# EAGLE design ARD-80A (EAGLE 6.6.0)
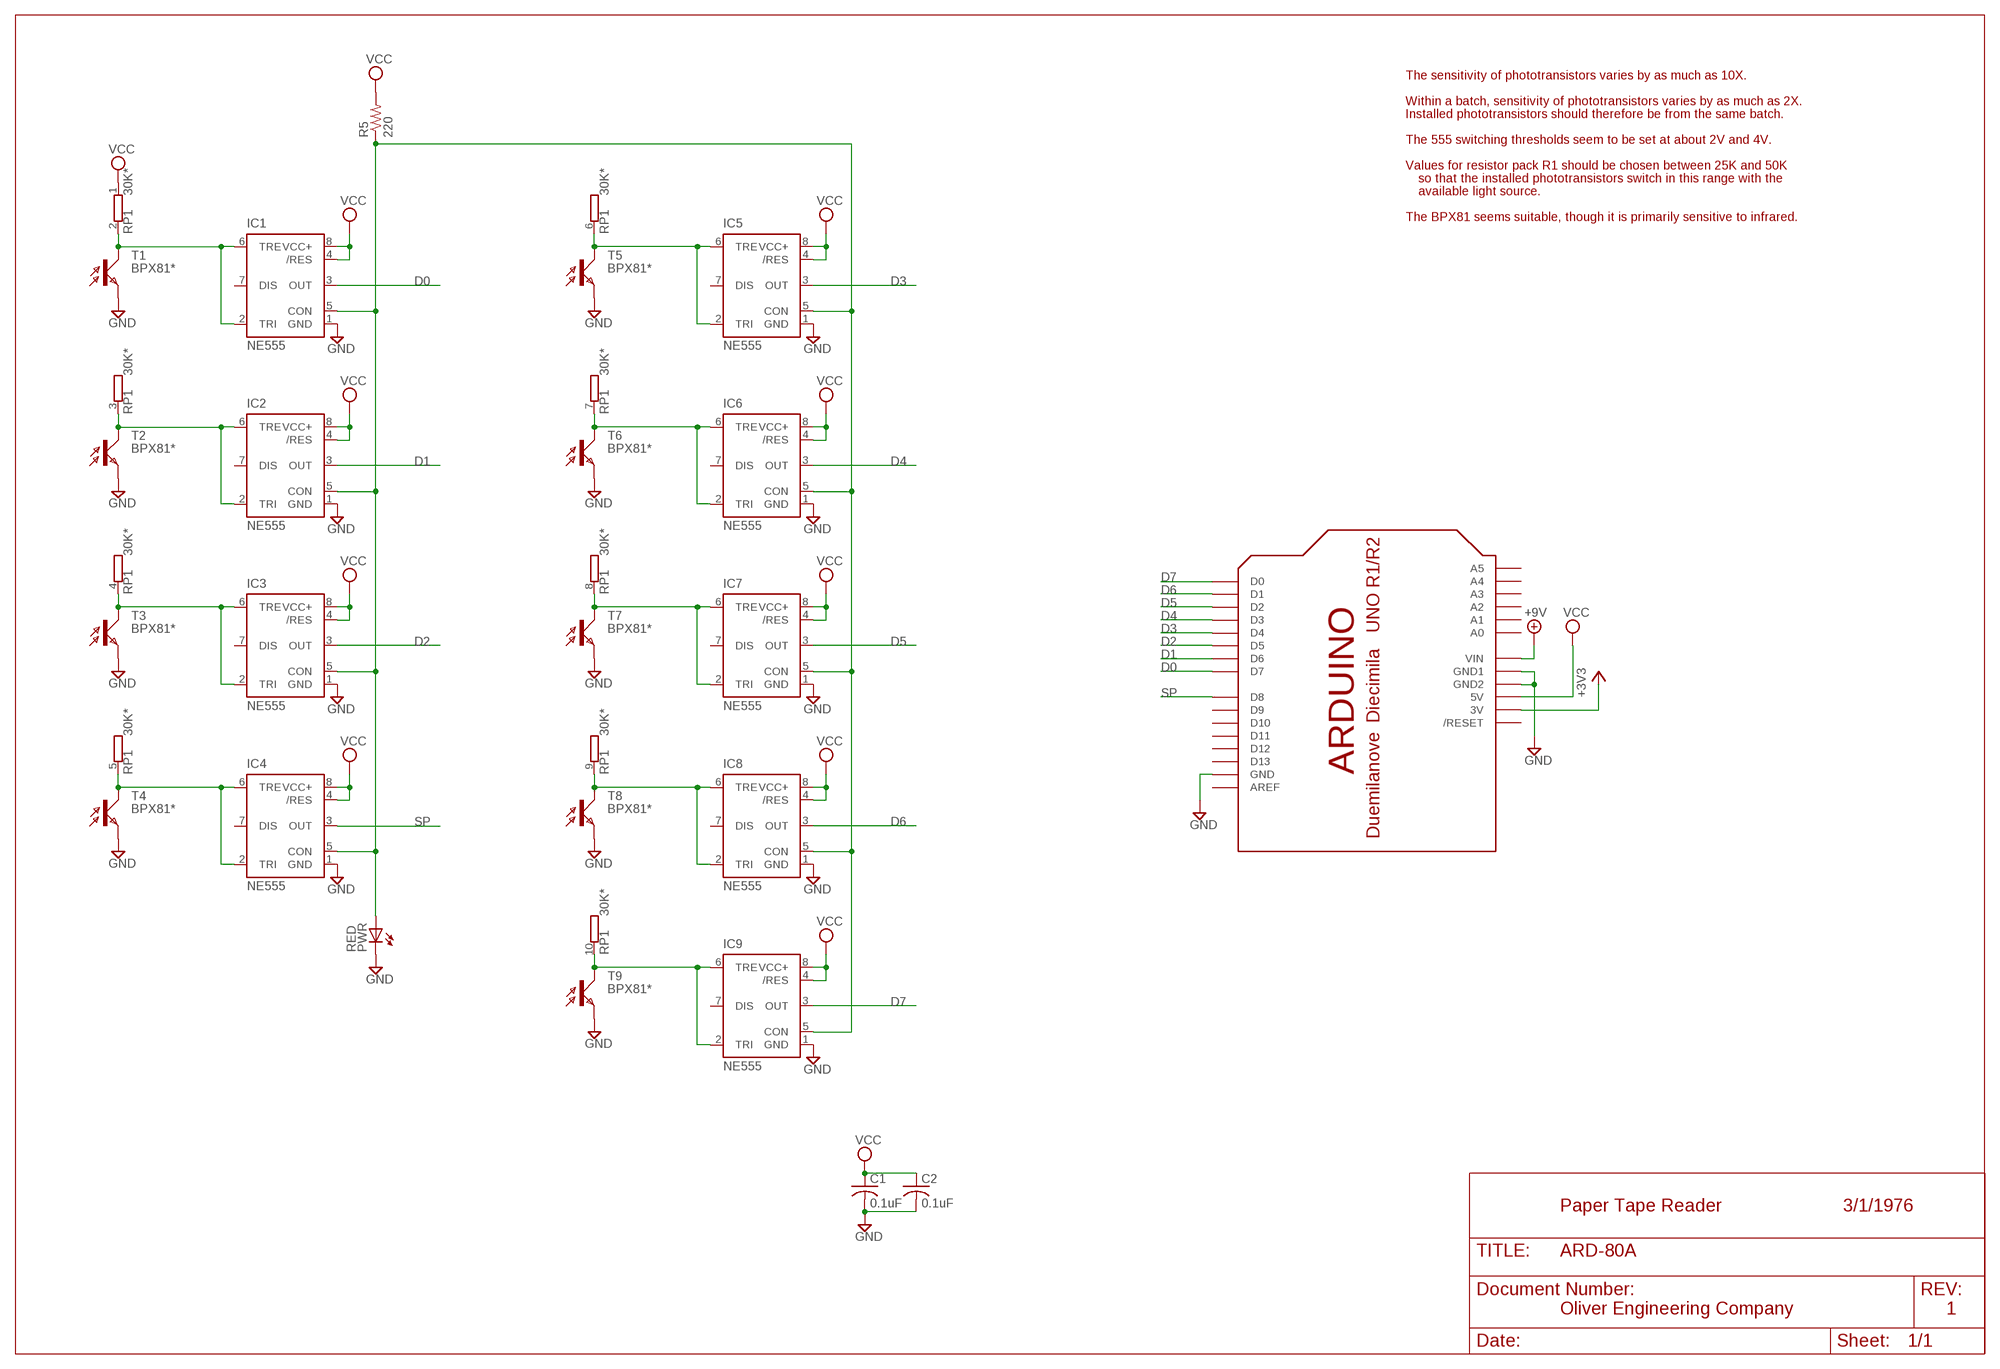
[diagram p0: schematic, sheet 1]

## Parts
C1  0.1uF  C-US050-030X075  [C050-030X075]
C2  0.1uF  C-US050-030X075  [C050-030X075]
IC1  NE555  [DIL-08]
IC2  NE555  [DIL-08]
IC3  NE555  [DIL-08]
IC4  NE555  [DIL-08]
IC5  NE555  [DIL-08]
IC6  NE555  [DIL-08]
IC7  NE555  [DIL-08]
IC8  NE555  [DIL-08]
IC9  NE555  [DIL-08]
PWR  RED  LED5MM  [LED5MM]
R5  220  R-US_0207/10  [0207/10]
RP1  30K*  GE09RP  [SIL10]
T1  BPX81*  BPX81  [BPX81]
T2  BPX81*  BPX81  [BPX81]
T3  BPX81*  BPX81  [BPX81]
T4  BPX81*  BPX81  [BPX81]
T5  BPX81*  BPX81  [BPX81]
T6  BPX81*  BPX81  [BPX81]
T7  BPX81*  BPX81  [BPX81]
T8  BPX81*  BPX81  [BPX81]
T9  BPX81*  BPX81  [BPX81]
U$2  ARDUINODUE  [ARDUINO_DUE_SHIELD]

## Nets
+3V3: U$2.3V3(3V)
+9V: U$2.VIN
D0: IC1.3(OUT) U$2.7(D7)
D1: IC2.3(OUT) U$2.6(D6)
D2: IC3.3(OUT) U$2.5(D5)
D3: IC5.3(OUT) U$2.4(D4)
D4: IC6.3(OUT) U$2.3(D3)
D5: IC7.3(OUT) U$2.2(D2)
D6: IC8.3(OUT) U$2.1(D1)
D7: IC9.3(OUT) U$2.0(D0)
GND [supply]: C1.2 C2.2 IC1.1(GND) IC2.1(GND) IC3.1(GND) IC4.1(GND) IC5.1(GND) IC6.1(GND) IC7.1(GND) IC8.1(GND) IC9.1(GND) PWR.K(C) T1.E T2.E T3.E T4.E T5.E T6.E T7.E T8.E T9.E U$2.GND U$2.GND_1(GND1) U$2.GND_2(GND2)
N$1: IC1.2(TRI) IC1.6(TRE) RP1.2 T1.C
N$3: IC1.5(CON) IC2.5(CON) IC3.5(CON) IC4.5(CON) IC5.5(CON) IC6.5(CON) IC7.5(CON) IC8.5(CON) IC9.5(CON) PWR.A R5.1
N$4: IC2.2(TRI) IC2.6(TRE) RP1.3 T2.C
N$7: IC3.2(TRI) IC3.6(TRE) RP1.4 T3.C
N$9: IC9.2(TRI) IC9.6(TRE) RP1.10 T9.C
N$10: IC4.2(TRI) IC4.6(TRE) RP1.5 T4.C
N$13: IC5.2(TRI) IC5.6(TRE) RP1.6 T5.C
N$15: IC6.2(TRI) IC6.6(TRE) RP1.7 T6.C
N$17: IC7.2(TRI) IC7.6(TRE) RP1.8 T7.C
N$19: IC8.2(TRI) IC8.6(TRE) RP1.9 T8.C
SP: IC4.3(OUT) U$2.8(D8)
VCC [supply]: C1.1 C2.1 IC1.4(/RES) IC1.8(VCC+) IC2.4(/RES) IC2.8(VCC+) IC3.4(/RES) IC3.8(VCC+) IC4.4(/RES) IC4.8(VCC+) IC5.4(/RES) IC5.8(VCC+) IC6.4(/RES) IC6.8(VCC+) IC7.4(/RES) IC7.8(VCC+) IC8.4(/RES) IC8.8(VCC+) IC9.4(/RES) IC9.8(VCC+) R5.2 RP1.1 U$2.5V0(5V)
Unconnected: IC1.7(DIS) IC2.7(DIS) IC3.7(DIS) IC4.7(DIS) IC5.7(DIS) IC6.7(DIS) IC7.7(DIS) IC8.7(DIS) IC9.7(DIS) U$2.9(D9) U$2.10(D10) U$2.11(D11) U$2.12(D12) U$2.13(D13) U$2.A0 U$2.A1 U$2.A2 U$2.A3 U$2.A4 U$2.A5 U$2.AREF U$2.RESET(/RESET)

## Notes on the sheet
- The sensitivity of phototransistors varies by as much as 10X.
- Within a batch, sensitivity of phototransistors varies by as much as 2X.
- Installed phototransistors should therefore be from the same batch.
- The 555 switching thresholds seem to be set at about 2V and 4V.
- Values for resistor pack R1 should be chosen between 25K and 50K
- so that the installed phototransistors switch in this range with the
- available light source.
- The BPX81 seems suitable, though it is primarily sensitive to infrared.
- Paper Tape Reader | 3/1/1976
- Oliver Engineering Company | 1

## Library data of the parts
C1 C2 = rcl:C-US: CAPACITOR, American symbol
IC1-IC9 = st-microelectronics:NE555: General purpose bipolar Timer; MF: Arrow Electronics; MPN: NE555N; OC_FARNELL: 1467742; OC_NEWARK: 89K1486
PWR = led:LED: LED OSRAM: - CHIPLED LG R971, LG N971, LY N971, LG Q971, LY Q971, LO R971, LY R971 LH N974, LH R974 LS Q976, LO Q976, LY Q976 LO Q996 - Hyper CHIPLED LW Q18S LB Q993, LB Q99A, LB R99A - SideLED LS A670, LO A670, LY A670, LG A670, LP A670 LB A673, LV A673, LT A673, LW A673 LH A674 LY A675 LS A676, LA A676, LO A676, LY A676, LW A676 LS A679, LY A679, LG A679 - Hyper Micro SIDELED® LS Y876, LA Y876, LO Y876, LY Y876 LT Y87S - SmartLED LW L88C, LW L88S LB L89C, LB L89S, LG L890 LS L89K, LO L89K, LY L89K LS L896, LA L896, LO L896, LY L896 - TOPLED LS T670, LO T670, LY T670, LG T670, LP T670 LSG T670, LSP T670, LSY T670, LOP T670, LYG T670 LG T671, LOG T671, LSG T671 LB T673, LV T673, LT T673, LW T673 LH T674 LS T676, LA T676, LO T676, LY T676, LB T676, LH T676, LSB T676, LW T676 LB T67C, LV T67C, LT T67C, LS T67K, LO T67K, LY T67K, LW E67C LS E67B, LA E67B, LO E67B, LY E67B, LB E67C, LV E67C, LT E67C LW T67C LS T679, LY T679, LG T679 LS T770, LO T770, LY T770, LG T770, LP T770 LB T773, LV T773, LT T773, LW T773 LH T774 LS E675, LA E675, LY E675, LS T675 LS T776, LA T776, LO T776, LY T776, LB T776 LHGB T686 LT T68C, LB T68C - Hyper Mini TOPLED® LB M676 - Mini TOPLED Santana® LG M470 LS M47K, LO M47K, LY M47K Source: http://www.osram.convergy.de LUXEON: - LUMILED® LXK2-PW12-R00, LXK2-PW12-S00, LXK2-PW14-U00, LXK2-PW14-V00 LXK2-PM12-R00, LXK2-PM12-S00, LXK2-PM14-U00 LXK2-PE12-Q00, LXK2-PE12-R00, LXK2-PE12-S00, LXK2-PE14-T00, LXK2-PE14-U00 LXK2-PB12-K00, LXK2-PB12-L00, LXK2-PB12-M00, LXK2-PB14-N00, LXK2-PB14-P00, LXK2-PB14-Q00 LXK2-PR12-L00, LXK2-PR12-M00, LXK2-PR14-Q00, LXK2-PR14-R00 LXK2-PD12-Q00, LXK2-PD12-R00, LXK2-PD12-S00 LXK2-PH12-R00, LXK2-PH12-S00 LXK2-PL12-P00, LXK2-PL12-Q00, LXK2-PL12-R00 Source: www.luxeon.com KINGBRIGHT: KA-3528ASYC Source: www.kingbright.com
R5 = rcl:R-US_: RESISTOR, American symbol
RP1 = resistor-sil:GE09RP: SIL RESISTOR; OC_FARNELL: unknown; OC_NEWARK: unknown
T1-T9 = opto-trans-siemens:BPX81: PHOTO TRANSISTOR; OC_FARNELL: unknown; OC_NEWARK: unknown
U$2 = arduino:ARDUINO: Arduino Diecimila/Duemilanove Make a shield with ease, this package has all the named pins as well as the two mounting drill holes and an outline of the USB and DC power connector. The outline is on the DIMENSION layer, so if your board house uses it they will cut the outline to match. http://www.ladyada.net/library/pcb/eaglelibrary.html

## Net classes
1 supply: width 0.61 mm

## Board
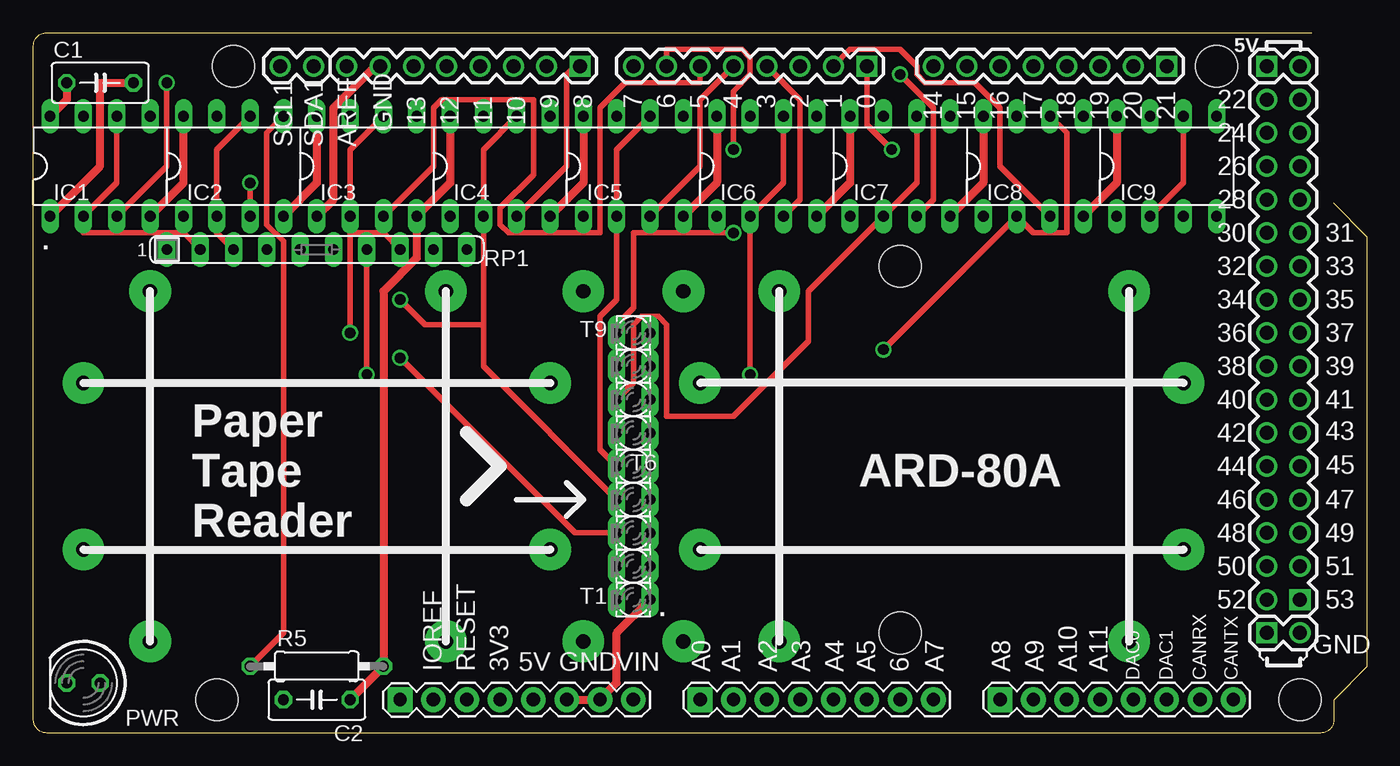
[diagram p1: board, top side]
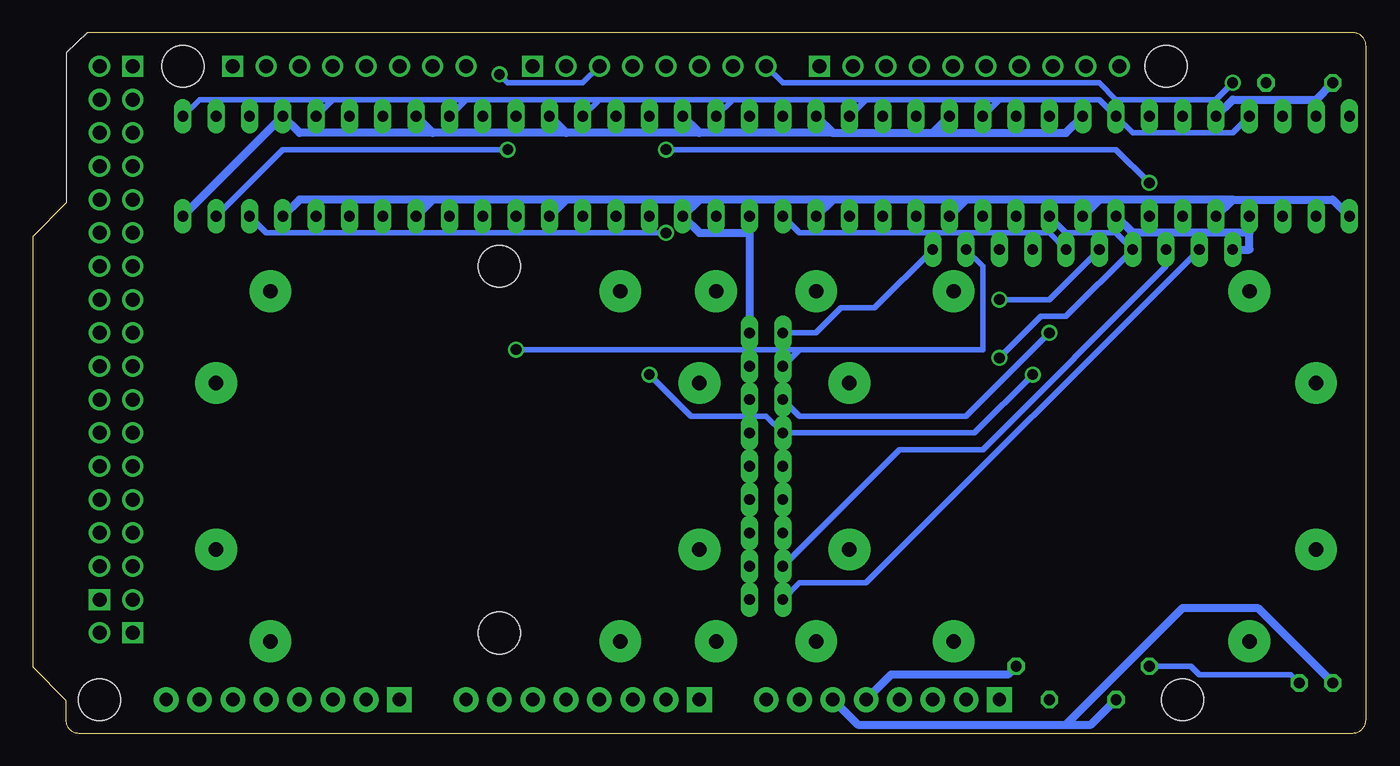
[diagram p2: board, bottom side, seen from below]

Size 101.6 x 53.34 mm. Coordinates in mm from the lower left corner, seen from the top.
Copper layers (1+16): Top 0.035mm / dielectric 1.5mm / Bottom 0.035mm
Design rules "16mils *": minimum track width 16mil, minimum drill 32mil, track to track 15mil, track to pad 10mil, pad to pad 10mil, via to via 10mil, smd to smd 10mil, copper to edge 13mil, drill to drill 10mil, minimum pad ring 10mil, minimum via ring 8mil, stop-mask expansion 0mil, vias tented up to drill 0mil, thermal gap 10mil

### Footprints (pad centres in the part's own frame; a part is rotated, then mirrored left to right if it is on the bottom)
C050-030X075 = drill 0.813 octagon: 1 -2.54,0; 2 2.54,0
DIL-08 = drill 0.813 long: 1 -3.81,-3.81; 2 -1.27,-3.81; 3 1.27,-3.81; 4 3.81,-3.81; 5 3.81,3.81; 6 1.27,3.81; 7 -1.27,3.81; 8 -3.81,3.81
LED5MM = drill 0.813 octagon: A -1.27,0; K 1.27,0
0207/10 = drill 0.813 octagon: 1 -5.08,0; 2 5.08,0
SIL10 = drill 0.813 long: 1 -11.43,0; 2 -8.89,0; 3 -6.35,0; 4 -3.81,0; 5 -1.27,0; 6 1.27,0; 7 3.81,0; 8 6.35,0; 9 8.89,0; 10 11.43,0
BPX81 = drill 0.813 long: C 1.27,0; E -1.27,0
ARDUINO_DUE_SHIELD = drill 1.067 square: 0 63.5,50.8; 5V0_1 93.98,50.8; 8 41.656,50.8; 21 86.36,50.8; 53 96.52,10.16; GND_4 93.98,7.62 | drill 1.067: 1 60.96,50.8; 2 58.42,50.8; 3 55.88,50.8; 4 53.34,50.8; 5 50.8,50.8; 5V0_2 96.52,50.8; 6 48.26,50.8; 7 45.72,50.8; 9 39.116,50.8; 10 36.576,50.8; 11 34.036,50.8; 12 31.496,50.8; 13 28.956,50.8; 14 68.58,50.8; 15 71.12,50.8; 16 73.66,50.8; 17 76.2,50.8; 18 78.74,50.8; 19 81.28,50.8; 20 83.82,50.8; 22 93.98,48.26; 23 96.52,48.26; 24 93.98,45.72; 25 96.52,45.72; 26 93.98,43.18; 27 96.52,43.18; 28 93.98,40.64; 29 96.52,40.64; 30 93.98,38.1; 31 96.52,38.1; 32 93.98,35.56; 33 96.52,35.56; 34 93.98,33.02; 35 96.52,33.02; 36 93.98,30.48; 37 96.52,30.48; 38 93.98,27.94; 39 96.52,27.94; 40 93.98,25.4; 41 96.52,25.4; 42 93.98,22.86; 43 96.52,22.86; 44 93.98,20.32; 45 96.52,20.32; 46 93.98,17.78; 47 96.52,17.78; 48 93.98,15.24; 49 96.52,15.24; 50 93.98,12.7; 51 96.52,12.7; 52 93.98,10.16; AREF 23.876,50.8; GND_2 26.416,50.8; GND_3 96.52,7.62; SCL1 18.796,50.8; SDA1 21.336,50.8 | drill 1.016 pad 1.88: 3V3 35.56,2.54; 5V0 38.1,2.54; A1 53.34,2.54; A2 55.88,2.54; A3 58.42,2.54; A4 60.96,2.54; A5 63.5,2.54; A6 66.04,2.54; A7 68.58,2.54; A9 76.2,2.54; A10 78.74,2.54; A11 81.28,2.54; CANRX 88.9,2.54; CANTX 91.44,2.54; DAC0 83.82,2.54; DAC1 86.36,2.54; GND 40.64,2.54; GND_1 43.18,2.54; IOREF 30.48,2.54; RESET 33.02,2.54; VIN 45.72,2.54 | drill 1.016 pad 1.88 square: A0 50.8,2.54; A8 73.66,2.54; NC_2 27.94,2.54 | hole 3.2: 96.52,2.54; 15.24,50.8; 90.17,50.8; 13.97,2.54; 66.04,35.56; 66.04,7.62

### Placement (x,y rotation side)
C1  5.08,49.53 0 top
C2  21.59,2.54 180 top
IC1  5.08,43.18 0 top
IC2  15.24,43.18 0 top
IC3  25.4,43.18 0 top
IC4  35.56,43.18 0 top
IC5  45.72,43.18 0 top
IC6  55.88,43.18 0 top
IC7  66.04,43.18 0 top
IC8  76.2,43.18 0 top
IC9  86.36,43.18 0 top
PWR  3.81,3.81 180 top
R5  21.59,5.08 0 top
RP1  21.59,36.83 0 top
T1  45.72,10.16 180 top
T2  45.72,12.7 180 top
T3  45.72,15.24 180 top
T4  45.72,17.78 180 top
T5  45.72,20.32 180 top
T6  45.72,22.86 180 top
T7  45.72,25.4 180 top
T8  45.72,27.94 180 top
T9  45.72,30.48 180 top
U$2  0,0 0 top

### Tracks (layer width: path | path; a pad name or v marks a point on that pad's centre or on a via)
D0  (via drill 0.81)
  Top 0.406: IC1.3 10.16,43.18 v10.16,49.53
  Bottom 0.406: v10.16,49.53 11.43,48.26 19.05,48.26 20.32,49.53 44.45,49.53 U$2.7
D1  (via drill 0.81)
  Top 0.406: v16.51,41.91 IC2.3 | v53.34,44.45 53.34,48.9 54.61,50.16 54.61,51.44 53.98,52.07 48.26,52.07 U$2.6
  Bottom 0.406: v16.51,41.91 19.05,44.45 v53.34,44.45
D2
  Top 0.406: IC3.3 30.48,43.18 30.48,47.62 31.11,48.26 38.1,48.26 38.1,42.55 35.56,40.01 35.56,38.73 36.2,38.1 43.18,38.1 43.18,47.62 45.09,49.53 50.8,49.53 U$2.5
D3
  Top 0.406: IC5.3 50.8,43.18 50.8,48.26 U$2.4
D4
  Top 0.406: IC6.3 58.42,40.64 58.42,48.26 U$2.3
D5  (via drill 0.81)
  Top 0.406: IC7.3 68.58,40.64 68.58,47.62 v66.04,50.16
  Bottom 0.406: v66.04,50.16 65.41,49.53 59.69,49.53 U$2.2
D6
  Top 0.406: IC8.3 73.66,43.18 73.66,47.62 71.75,49.53 67.94,49.53 67.31,50.16 67.31,50.8 66.04,52.07 62.23,52.07 U$2.1
D7  (via drill 0.81)
  Top 0.406: v65.41,44.45 63.5,46.35 U$2.0
  Bottom 0.406: IC9.3 82.55,44.45 v65.41,44.45
GND
  Top 0.61: T9.E T8.E T7.E T6.E T5.E T4.E T3.E T2.E T1.E 44.45,7.62 44.45,3.81 U$2.GND_1 U$2.GND | C1.2 5.08,49.53 5.08,43.18 IC1.1 | IC3.1 22.86,40.64 22.86,47.62 26.04,50.8 U$2.GND_2
  Bottom 0.61: C2.2 20.95,0.64 22.86,0.64 | 22.86,0.64 38.73,0.64 U$2.GND | PWR.K 8.26,9.53 13.97,9.53 22.86,0.64 | IC1.1 2.54,40.64 10.16,40.64 | IC2.1 10.16,40.64 | 20.32,40.64 IC3.1 | 10.16,40.64 20.32,40.64 | 30.48,40.64 IC4.1 | 20.32,40.64 30.48,40.64 | 40.64,40.64 IC5.1 | 30.48,40.64 40.64,40.64 | 50.8,40.64 IC6.1 50.8,38.1 46.99,38.1 T9.E | 40.64,40.64 50.8,40.64 | 60.96,40.64 IC7.1 | 50.8,40.64 60.96,40.64 | 71.12,40.64 IC8.1 | 60.96,40.64 71.12,40.64 | IC9.1 81.28,40.64 71.12,40.64
N$1
  Top 0.406: IC1.6 6.35,41.91 IC1.2 3.81,38.1 11.43,38.1 RP1.2
  Bottom 0.406: T1.C 43.18,11.43 38.1,11.43 RP1.2
N$2  (via drill 1.1 pad 3.17)
  other vias: 49.53,33.66
N$3
  Top 0.406: R5.1 19.05,7.62 19.05,37.47 17.78,38.73 17.78,45.72 IC2.5
  Bottom 0.406: PWR.A 5.71,4.45 12.7,4.45 13.34,5.08 R5.1 | IC1.5 10.16,45.72 17.78,45.72 IC2.5 20.32,48.26 27.94,48.26 | 27.94,48.26 IC3.5 | 38.1,48.26 IC4.5 | 27.94,48.26 38.1,48.26 | 48.26,48.26 IC5.5 | 38.1,48.26 48.26,48.26 | 58.42,48.26 IC6.5 | 48.26,48.26 58.42,48.26 | 68.58,48.26 IC7.5 | 58.42,48.26 68.58,48.26 | 78.74,48.26 IC8.5 | 68.58,48.26 78.74,48.26 | IC9.5 88.9,48.26 78.74,48.26
N$4
  Top 0.406: RP1.3 13.97,38.1 IC2.2 13.97,44.45 IC2.6
  Bottom 0.406: T2.C 35.56,21.59 29.21,21.59 15.24,35.56 RP1.3
N$5  (via drill 1.1 pad 3.17)
  other vias: 8.89,33.66
N$6  (via drill 1.1 pad 3.17)
  other vias: 3.81,26.67
N$7  (via drill 0.81)
  Top 0.406: T3.C 41.27,15.24 v27.94,28.57 | IC3.6 24.13,44.45 IC3.2
  Bottom 0.406: IC3.2 22.86,38.1 19.05,38.1 RP1.4 22.86,31.75 24.77,31.75 v27.94,28.57
N$8  (via drill 1.1 pad 3.17)
  other vias: 56.83,6.99
N$9  (via drill 0.81)
  Top 0.406: IC9.2 87.63,41.91 IC9.6 | v53.34,38.1 45.72,38.1 45.72,32.38 44.45,31.11 T9.C
  Bottom 0.406: RP1.10 37.47,32.38 40.01,32.38 41.91,30.48 T9.C | IC9.2 83.82,38.1 v53.34,38.1
N$10  (via drill 0.81)
  Top 0.406: v27.94,33.02 29.84,31.11 34.29,31.11 | 34.29,31.11 IC4.2 34.29,44.45 IC4.6 | T4.C 34.29,27.94 34.29,31.11
  Bottom 0.406: RP1.5 24.13,33.02 v27.94,33.02
N$13
  Top 0.406: T5.C 43.18,21.59 43.18,31.75 44.45,33.02 IC5.2 44.45,44.45 IC5.6
  Bottom 0.406: RP1.6 24.13,38.1 43.18,38.1 IC5.2
N$15  (via drill 0.81)
  Top 0.406: IC6.6 57.15,41.91 IC6.2 v54.61,27.3 | v25.4,27.3 RP1.7
  Bottom 0.406: v25.4,27.3 29.84,22.86 T6.C 45.72,24.13 51.44,24.13 v54.61,27.3
N$16  (via drill 1.1 pad 3.17)
  other vias: 3.81,13.97
N$17  (via drill 0.81)
  Top 0.406: IC7.6 67.31,41.91 IC7.2 59.05,33.66 59.05,29.84 53.34,24.13 48.26,24.13 48.26,31.11 47.62,31.75 46.35,31.75 45.72,31.11 45.72,26.67 T7.C | RP1.8 26.67,38.1 24.13,38.1 v24.13,30.48
  Bottom 0.406: v24.13,30.48 30.48,24.13 43.18,24.13 T7.C
N$18  (via drill 1.1 pad 3.17)
  other vias: 31.43,33.66
N$19  (via drill 0.81)
  Top 0.406: IC8.6 78.74,45.72 78.74,38.1 76.2,38.1 IC8.2 v64.77,29.21
  Bottom 0.406: RP1.9 29.21,35.56 29.21,29.21 43.18,29.21 | T8.C 43.18,29.21 | 43.18,29.21 v64.77,29.21
N$20  (via drill 1.1 pad 3.17)
  other vias: 41.91,33.66
N$21  (via drill 1.1 pad 3.17)
  other vias: 56.83,33.66
N$22  (via drill 1.1 pad 3.17)
  other vias: 83.5,33.66
N$23  (via drill 1.1 pad 3.17)
  other vias: 39.37,26.67
N$24  (via drill 1.1 pad 3.17)
  other vias: 50.8,26.67
N$25  (via drill 1.1 pad 3.17)
  other vias: 50.8,13.97
N$26  (via drill 1.1 pad 3.17)
  other vias: 39.37,13.97
N$27  (via drill 1.1 pad 3.17)
  other vias: 8.89,6.99
N$28  (via drill 1.1 pad 3.17)
  other vias: 31.43,6.99
N$29  (via drill 1.1 pad 3.17)
  other vias: 41.91,6.99
N$30  (via drill 1.1 pad 3.17)
  other vias: 83.5,6.99
N$31  (via drill 1.1 pad 3.17)
  other vias: 49.53,6.99
N$34  (via drill 1.1 pad 3.17)
  other vias: 87.63,26.67
N$35  (via drill 1.1 pad 3.17)
  other vias: 87.63,13.97
SP
  Top 0.406: IC4.3 40.64,43.18 40.64,50.16 41.27,50.8 U$2.8
VCC
  Top 0.61: IC2.4 21.59,41.91 IC3.8 | IC1.8 2.54,48.26 C1.1 | IC2.8 11.43,41.91 IC1.4 | C2.1 R5.2 26.67,33.66 29.21,36.2 IC3.4 31.75,41.91 IC4.8 | IC8.4 82.55,41.91 IC9.8 | IC7.4 72.39,41.91 IC8.8 | IC6.4 62.23,41.91 IC7.8 | IC5.4 52.07,41.91 IC6.8 | IC4.4 41.91,41.91 IC5.8
  Bottom 0.61: 8.89,38.1 8.89,36.83 RP1.1 | 8.89,38.1 IC1.4 | C1.1 3.81,48.26 10.16,48.26 IC2.8 | IC2.4 17.78,38.1 8.89,38.1 | U$2.5V0 36.2,4.45 27.3,4.45 R5.2 | IC9.4 IC9.8 81.28,45.72 71.12,45.72 | 33.02,45.72 IC4.8 | 40.64,45.72 33.02,45.72 | IC5.8 40.64,45.72 | 50.8,45.72 IC6.8 | 40.64,45.72 50.8,45.72 | 60.96,45.72 IC7.8 | 50.8,45.72 60.96,45.72 | 71.12,45.72 IC8.8 | 60.96,45.72 71.12,45.72 | IC3.8 22.86,45.72 33.02,45.72

### Text on the board
tPlace: . | Paper | Tape | ARD-80A | Reader | .